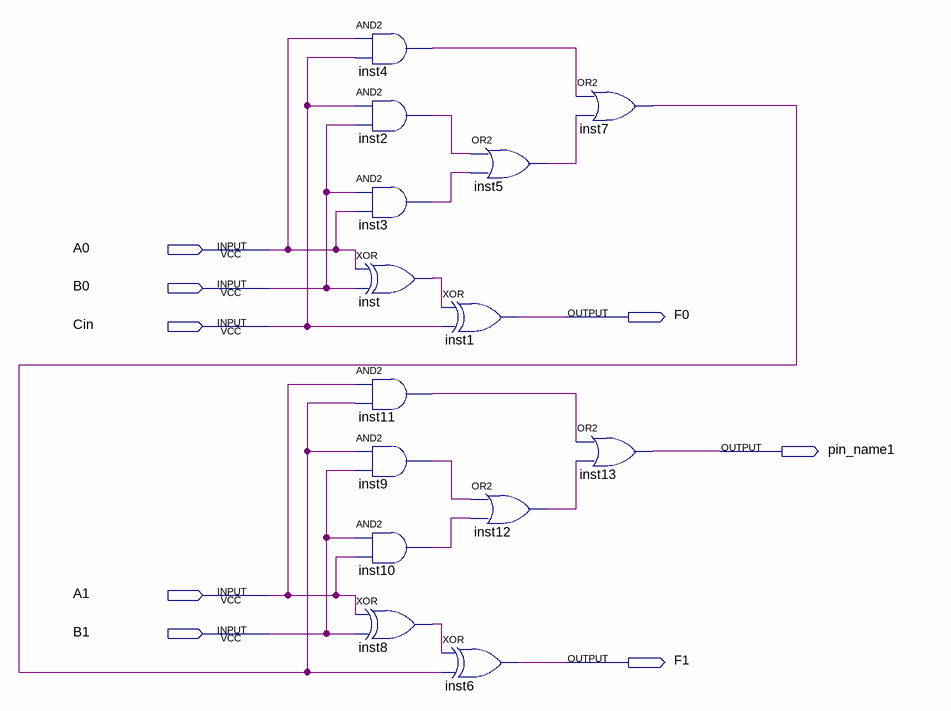
[diagram p0: schematic sheet]
// Quartus schematic Ex6_two_bit.bdf as structural Verilog: 14 symbols, 8 pins
module Ex6_two_bit (
  input  A0,
  input  B0,
  input  Cin,
  input  A1,
  input  B1,
  output F0,
  output pin_name1,
  output F1
);

  wire inst2_out, inst3_out, inst4_out, inst5_out, inst7_out, inst8_out, inst9_out, inst10_out, inst11_out,
       inst12_out, inst_out;

  and inst4 (inst4_out, A0, Cin);
  and inst2 (inst2_out, Cin, B0);
  and inst3 (inst3_out, B0, A0);
  xor inst (inst_out, A0, B0);
  and inst11 (inst11_out, A1, inst7_out);
  and inst9 (inst9_out, inst7_out, B1);
  and inst10 (inst10_out, B1, A1);
  xor inst8 (inst8_out, A1, B1);
  or inst5 (inst5_out, inst2_out, inst3_out);
  xor inst1 (F0, inst_out, Cin);
  or inst12 (inst12_out, inst9_out, inst10_out);
  xor inst6 (F1, inst8_out, inst7_out);
  or inst7 (inst7_out, inst4_out, inst5_out);
  or inst13 (pin_name1, inst11_out, inst12_out);
endmodule
